# EAGLE design Right (EAGLE 8.2.1)
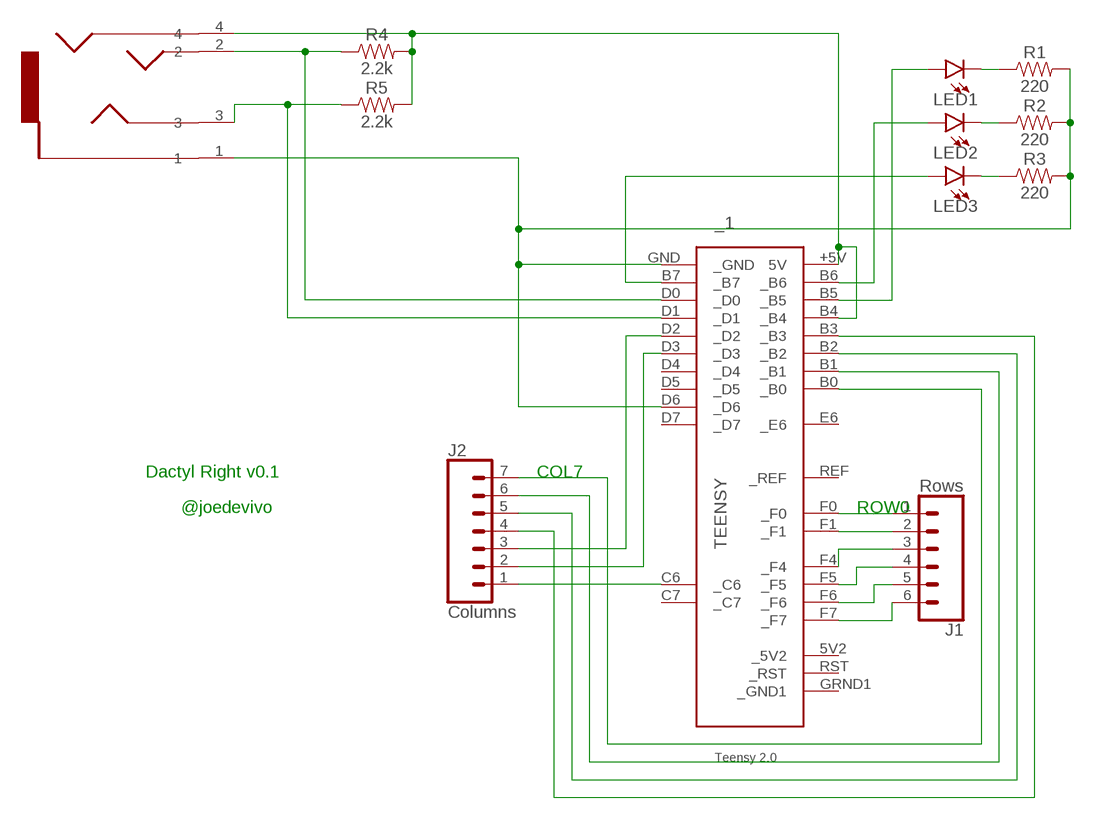
[diagram p0: schematic, sheet 1]

## Parts
_1  TEENSY  [TEENSY]
J1  Rows  CONN_06SILK_FEMALE_PTH  [1X06]
J2  Columns  CONN_07  [1X07]
LED1  LED3MM  [LED_3MM]
LED2  LED3MM  [LED_3MM]
LED3  LED3MM  [LED_3MM]
R1  220  RESISTORAXIAL-0.3  [AXIAL-0.3]
R2  220  RESISTORAXIAL-0.3  [AXIAL-0.3]
R3  220  RESISTORAXIAL-0.3  [AXIAL-0.3]
R4  2.2k  RESISTORAXIAL-0.3  [AXIAL-0.3]
R5  2.2k  RESISTORAXIAL-0.3  [AXIAL-0.3]
U$2  SJ-43514_HEADPHONES_3.5MM_X4  [SJ-43514_HEADPHONES-3.5MM_X4]

## Nets
COL7: _1.B0(_B0) J2.7
N$1: LED1.K(C) R1.P$1
N$2: LED2.K(C) R2.P$1
N$3: LED3.K(C) R3.P$1
N$4: _1.B5(_B5) LED1.A
N$5: _1.B6(_B6) LED2.A
N$6: _1.B7(_B7) LED3.A
N$7: _1.+5V(5V) _1.B4(_B4) R4.P$2 R5.P$2 U$2.4
N$8: _1.D0(_D0) R4.P$1 U$2.2
N$9: _1.D1(_D1) R5.P$1 U$2.3
N$10: _1.D3(_D3) J2.2
N$11: _1.D6(_D6) _1.GND(_GND) R1.P$2 R2.P$2 R3.P$2 U$2.1
N$12: _1.D2(_D2) J2.3
N$14: _1.C6(_C6) J2.1
N$15: _1.F1(_F1) J1.2
N$16: _1.F4(_F4) J1.3
N$17: _1.F5(_F5) J1.4
N$18: _1.F6(_F6) J1.5
N$19: _1.F7(_F7) J1.6
N$21: _1.B1(_B1) J2.6
N$22: _1.B2(_B2) J2.5
N$23: _1.B3(_B3) J2.4
ROW0: _1.F0(_F0) J1.1
Unconnected: _1.5V2(_5V2) _1.C7(_C7) _1.D4(_D4) _1.D5(_D5) _1.D7(_D7) _1.E6(_E6) _1.GRND1(_GND1) _1.REF(_REF) _1.RST(_RST)

## Notes on the sheet
- Dactyl Right v0.1
- @joedevivo

## Library data of the parts
_1 = teensy:TEENSY: Teensy 2.0 Original Design by Clint Fisher Modified Design by Tamir Emran Licensed Under Creative Commons Attribution-ShareAlike 3.0 Unported (CC BY-SA 3.0)
J1 = SparkFun-Connectors:CONN_06: Multi connection point. Often used as Generic Header-pin footprint for 0.1 inch spaced/style header connections On any of the 0.1 inch spaced packages, you can populate with these: Break Away Headers - Straight <https://www.sparkfun.com/products/116> (PRT-00116) Break Away Male Headers - Right Angle <https://www.sparkfun.com/products/553> (PRT-00553) Female Headers <https://www.sparkfun.com/products/115> (PRT-00115) Break Away Headers - Machine Pin <https://www.sparkfun.com/products/117> (PRT-00117) Break Away Female Headers - Swiss Machine Pin <https://www.sparkfun.com/products/743> (PRT-00743) Arduino Stackable Header - 6 Pin <https://www.sparkfun.com/products/9280> (PRT-09280) For SCREWTERMINALS and SPRING TERMINALS visit here: Screw Terimnals on SparkFun.com <https://www.sparkfun.com/search/results?term=Screw+Terminals> (5mm/3.5mm/2.54mm spacing) This device is also useful as a general connection point to wire up your design to another part of your project. Our various solder wires solder well into these plated through hole pads. Hook-Up Wire - Assortment (Stranded, 22 AWG) <https://www.sparkfun.com/products/11375> (PRT-11375) Hook-Up Wire - Assortment (Solid Core, 22 AWG) <https://www.sparkfun.com/products/11367> (PRT-11367) View the entire wire category on our website here <https://www.sparkfun.com/categories/141>; PROD_ID: CONN-08437
J2 = SparkFun-Connectors:CONN_07: Multi connection point. Often used as Generic Header-pin footprint for 0.1 inch spaced/style header connections On any of the 0.1 inch spaced packages, you can populate with these: Break Away Headers - Straight <https://www.sparkfun.com/products/116> (PRT-00116) Break Away Male Headers - Right Angle <https://www.sparkfun.com/products/553> (PRT-00553) Female Headers <https://www.sparkfun.com/products/115> (PRT-00115) Break Away Headers - Machine Pin <https://www.sparkfun.com/products/117> (PRT-00117) Break Away Female Headers - Swiss Machine Pin <https://www.sparkfun.com/products/743> (PRT-00743) For SCREWTERMINALS and SPRING TERMINALS visit here: Screw Terimnals on SparkFun.com <https://www.sparkfun.com/search/results?term=Screw+Terminals> (5mm/3.5mm/2.54mm spacing) This device is also useful as a general connection point to wire up your design to another part of your project. Our various solder wires solder well into these plated through hole pads. Hook-Up Wire - Assortment (Stranded, 22 AWG) <https://www.sparkfun.com/products/11375> (PRT-11375) Hook-Up Wire - Assortment (Solid Core, 22 AWG) <https://www.sparkfun.com/products/11367> (PRT-11367) View the entire wire category on our website here <https://www.sparkfun.com/categories/141> Special notes: Molex polarized connector foot print use with SKU : PRT-08231 with associated crimp pins and housings. 1MM SMD Version SKU: PRT-10208 NOTES ON THE VARIANTS LOCK and LOCK_LONGPADS... This footprint was designed to help hold the alignment of a through-hole component (i.e. 6-pin header) while soldering it into place. You may notice that each hole has been shifted either up or down by 0.005 of an inch from it's more standard position (which is a perfectly straight line). This slight alteration caused the pins (the squares in the middle) to touch the edges of the holes. Because they are alternating, it causes a "brace" to hold the component in place. 0.005 has proven to be the perfect amount of "off-center" position when using our standard breakaway headers. Although looks a little odd when you look at the bare footprint, once you have a header in there, the alteration is very hard to notice. Also,if you push a header all the way into place, it is covered up entirely on the bottom side.
LED1-LED3 = SparkFun-LED:LED: LED (Generic) Standard schematic elements and footprints for 5mm, 3mm, 1206, and 0603 sized LEDs. Generic LEDs with no color specified.; PROD_ID: DIO-08794
R1-R5 = SparkFun-Resistors:RESISTOR: Generic Resistor Package
U$2 = my_parts:SJ-43514_HEADPHONES_3.5MM_X4: This is for the SJ-43514 3.5mm 4-conductor headphone jack. Also works with SJ-4351X and SJ-43515TS

## Board
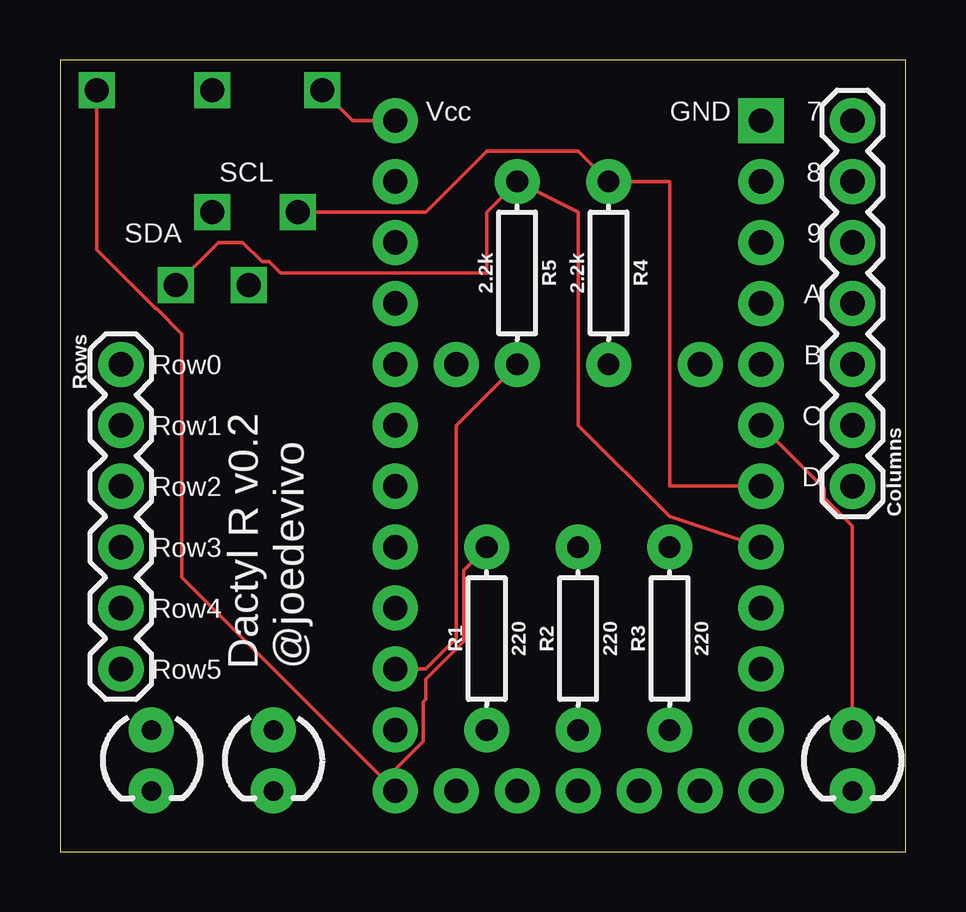
[diagram p1: board, top side]
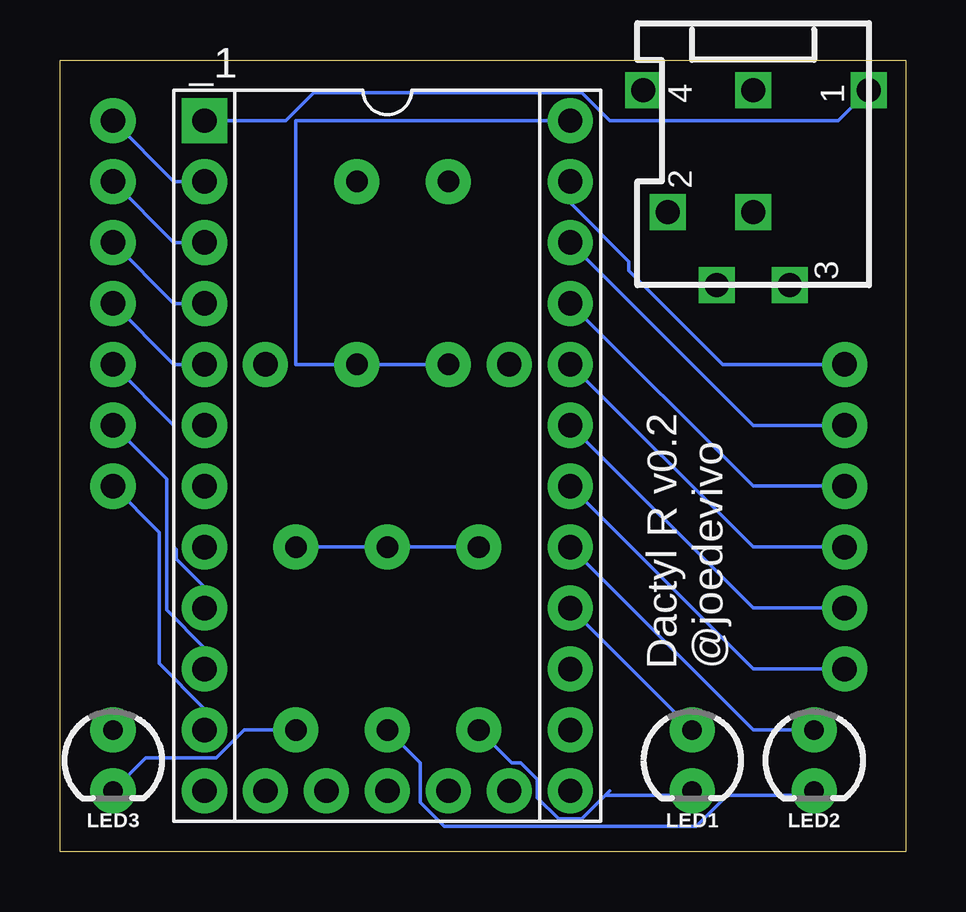
[diagram p2: board, bottom side, seen from below]

Size 35.23 x 33.01 mm. Coordinates in mm from the lower left corner, seen from the top.
Outline: 0,0 35.23,0 35.23,33.01 0,33.01 0,0
Copper layers (1*16): Top 0.0356mm / dielectric 1.5011mm / Bottom 0.0356mm
Design rules "oshpark-2layer": minimum track width 6mil, minimum drill 13mil, track to track 6mil, track to pad 6mil, pad to pad 6mil, via to via 6mil, smd to smd 6mil, copper to edge 15mil, drill to drill 6mil, minimum pad ring 7mil, minimum via ring 7mil, stop-mask expansion 2.5mil, vias tented up to drill 0mil, thermal gap 10mil

### Footprints (pad centres in the part's own frame; a part is rotated, then mirrored left to right if it is on the bottom)
TEENSY = drill 1.016 pad 1.88: 5V2 13.97,-2.54; +5V -13.97,7.62; B0 -11.43,-7.62; B1 -8.89,-7.62; B2 -6.35,-7.62; B3 -3.81,-7.62; B4 8.89,7.62; B5 6.35,7.62; B6 3.81,7.62; B7 -1.27,-7.62; C6 11.43,-7.62; C7 13.97,-7.62; D0 1.27,-7.62; D1 3.81,-7.62; D2 6.35,-7.62; D3 8.89,-7.62; D4 13.97,5.08; D5 13.97,-5.08; D6 13.97,7.62; D7 11.43,7.62; E6 -3.81,-5.08; F0 -11.43,7.62; F1 -8.89,7.62; F4 -6.35,7.62; F5 -3.81,7.62; F6 -1.27,7.62; F7 1.27,7.62; GRND1 13.97,0; REF -3.81,5.08; RST 13.97,2.54 | drill 1.016 pad 1.88 square: GND -13.97,-7.62
1X06 = drill 1.016 pad 1.88: 1 0,0; 2 2.54,0; 3 5.08,0; 4 7.62,0; 5 10.16,0; 6 12.7,0
1X07 = drill 1.016 pad 1.88: 1 0,0; 2 2.54,0; 3 5.08,0; 4 7.62,0; 5 10.16,0; 6 12.7,0; 7 15.24,0
LED_3MM = drill 0.813 pad 1.88: A -1.27,0; K 1.27,0
AXIAL-0.3 = drill 0.9 pad 1.88: P$1 -3.81,0; P$2 3.81,0
SJ-43514_HEADPHONES-3.5MM_X4 = drill 1 square: 1 0,4.826; 2 5.08,-3.556; 3 8.128,1.524; 4 0,-4.572; 5 8.128,-1.524; NC 0,0; NC2 5.08,0

### Placement (x,y rotation side)
_1  21.59,16.51 270 bottom
J1  2.54,20.32 270 top
J2  33.02,15.24 90 top
LED1  8.89,3.81 270 bottom
LED2  3.81,3.81 270 bottom
LED3  33.02,3.81 270 bottom
R1  17.78,8.89 90 top
R2  21.59,8.89 90 top
R3  25.4,8.89 90 top
R4  22.86,24.13 270 top
R5  19.05,24.13 270 top
U$2  6.35,31.75 270 bottom

### Tracks (layer width: path | path; a pad name or v marks a point on that pad's centre or on a via)
COL7
  Bottom 0.152: _1.B0 30.48,27.94 J2.7
N$1
  Bottom 0.152: R1.P$1 16.41,3.71 16.03,3.71 15.34,3.02 15.34,2.26 14.45,1.37 13.49,1.37 12.51,2.35 | 12.32,2.54 12.51,2.35 | 12.51,2.35 9.08,2.35 LED1.K
N$2
  Bottom 0.152: 7.24,2.54 7.43,2.35 | 7.43,2.35 8.71,1.07 19.23,1.07 20.22,2.06 20.22,3.71 R2.P$1 | 7.43,2.35 4,2.35 LED2.K
N$3
  Bottom 0.152: R3.P$1 27.56,5.08 28.73,3.91 31.65,3.91 LED3.K
N$4
  Bottom 0.152: LED1.A _1.B5
N$5
  Bottom 0.152: _1.B6 6.35,5.08 LED2.A
N$6
  Top 0.152: _1.B7 31.85,15.14 31.85,14.76 33.02,13.59 LED3.A
N$7
  Top 0.152: _1.+5V 12.19,30.48 U$2.4 | _1.B4 15.24,7.62 16.51,8.89 16.51,17.78 R5.P$2
  Bottom 0.152: _1.+5V 25.4,30.48 25.4,20.32 R4.P$2 R5.P$2
N$8
  Top 0.152: U$2.2 15.24,26.67 17.78,29.21 21.59,29.21 R4.P$1 25.4,27.94 25.4,15.24 _1.D0
N$9
  Top 0.152: _1.D1 25.4,13.97 21.59,17.78 21.59,26.67 R5.P$1 17.78,26.67 17.78,24.13 9.19,24.13 8.72,24.6 8.42,24.6 7.62,25.4 6.6,25.4 U$2.3
N$10
  Bottom 0.152: _1.D3 29.21,8.51 30.79,10.08 30.79,15.55 J2.2
N$11
  Top 0.152: U$2.1 1.52,25.1 3.98,22.64 4.03,22.64 5.08,21.59 5.08,11.43 _1.D6 13.97,3.43 15.14,4.6 15.14,6.25 15.24,6.35 15.24,7.19 16.82,8.76 16.82,11.73 R1.P$2
  Bottom 0.152: U$2.1 2.79,30.48 12.32,30.48 13.49,31.65 24.66,31.65 25.83,30.48 _1.GND | R1.P$2 R2.P$2 R3.P$2
N$12
  Bottom 0.152: _1.D2 29.21,11.05 30.38,12.22 30.38,12.6 30.48,12.7 30.48,17.78 J2.3
N$14
  Bottom 0.152: J2.1 31.09,13.31 31.09,7.85 29.21,5.97 _1.C6
N$15
  Bottom 0.152: J1.2 6.35,17.78 _1.F1
N$16
  Bottom 0.152: J1.3 6.35,15.24 _1.F4
N$17
  Bottom 0.152: J1.4 6.35,12.7 _1.F5
N$18
  Bottom 0.152: J1.5 6.35,10.16 _1.F6
N$19
  Bottom 0.152: J1.6 6.35,7.62 _1.F7
N$21
  Bottom 0.152: _1.B1 30.48,25.4 J2.6
N$22
  Bottom 0.152: _1.B2 30.48,22.86 J2.5
N$23
  Bottom 0.152: _1.B3 30.48,20.32 J2.4
ROW0
  Bottom 0.152: _1.F0 13.97,27.05 11.53,24.61 11.53,24.23 7.62,20.32 J1.1

### Text on the board
tNames: Vcc | GND | 7 | SCL | 8 | SDA | 9 | A | Row0 | B | Row1 | C | Row2 | D | Row3 | Row4 | Row5 | Dactyl R v0.2 / @joedevivo
bNames: Dactyl R v0.2 / @joedevivo